# EAGLE design Arduino Mega Breakout - Schematic (EAGLE 6.5.0)
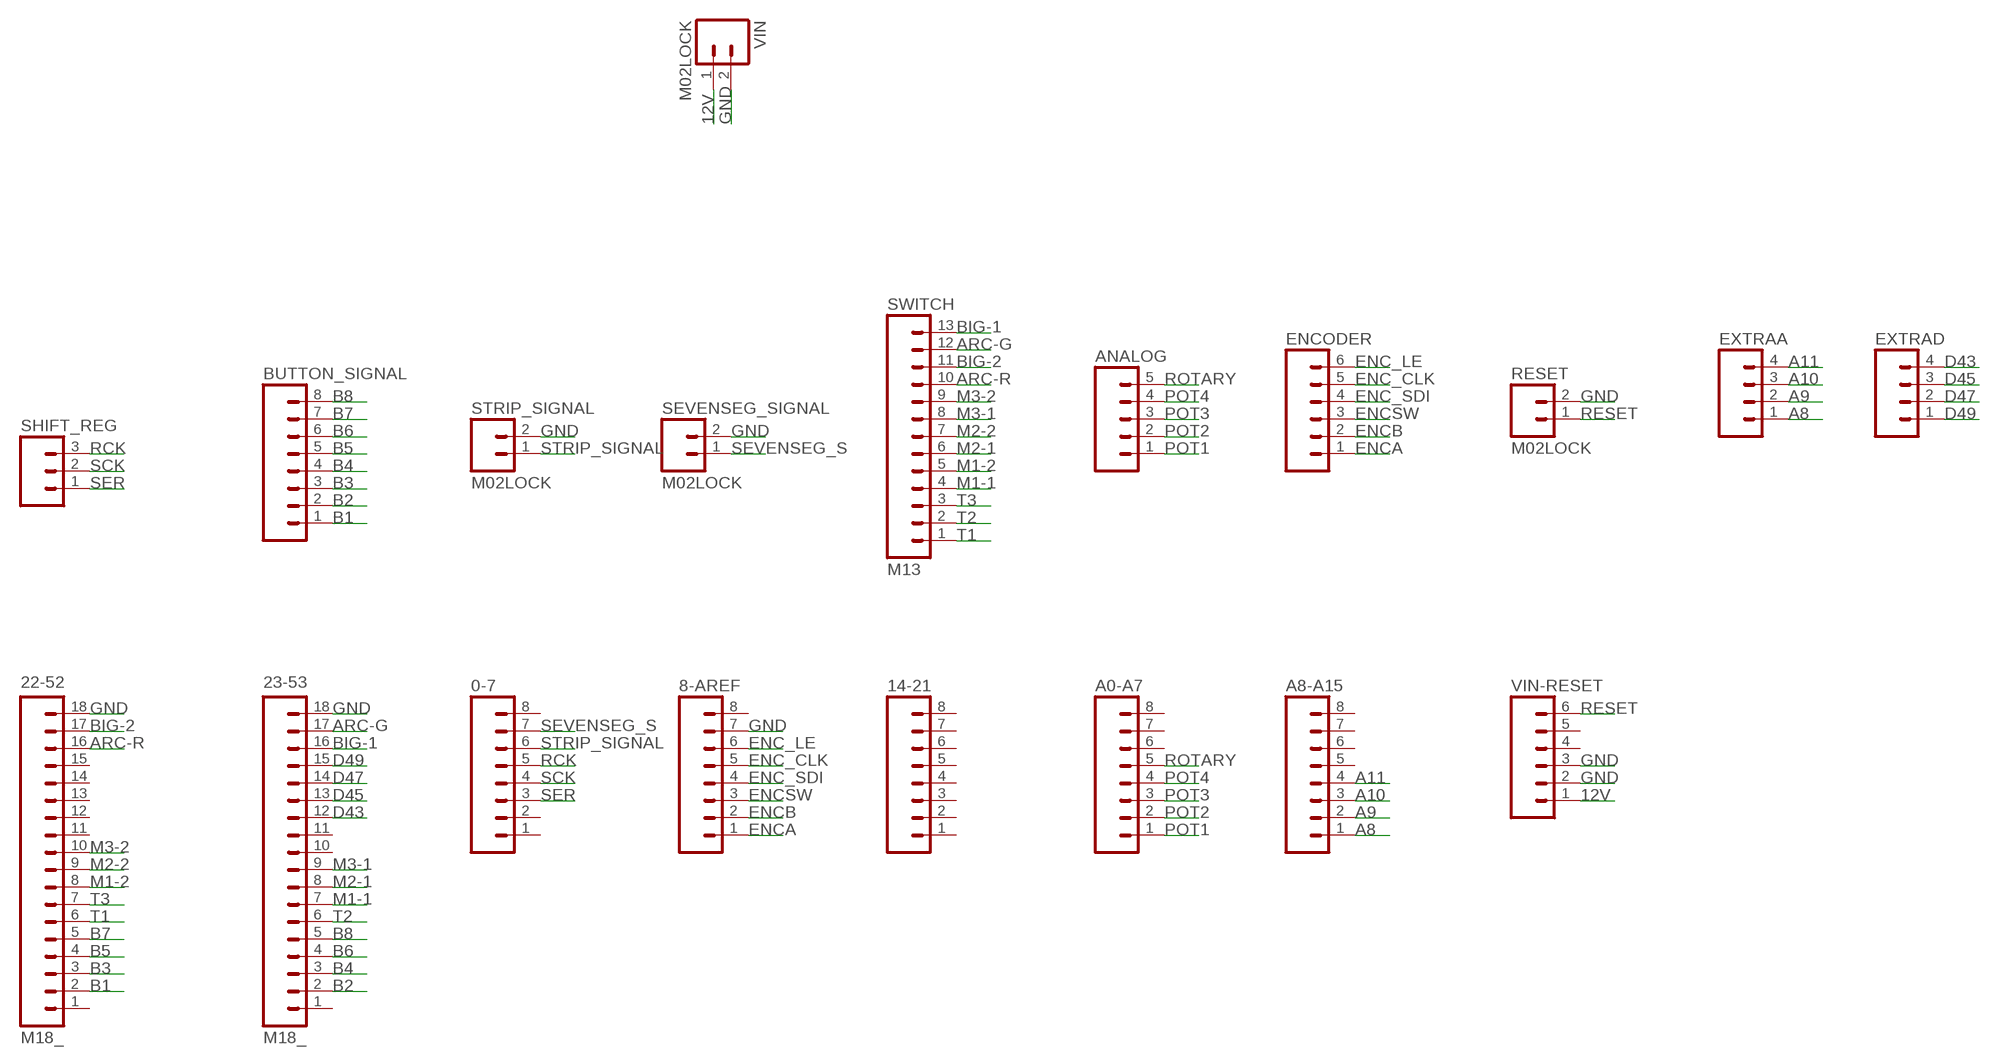
[diagram p0: schematic, sheet 1]

## Parts
0-7  M08LOCK  [1X08_LOCK]
8-AREF  M08LOCK  [1X08_LOCK]
14-21  M08LOCK  [1X08_LOCK]
22-52  M18_  [1X18]
23-53  M18_  [1X18]
A0-A7  M08LOCK  [1X08_LOCK]
A8-A15  M08LOCK  [1X08_LOCK]
ANALOG  M05LOCK  [1X05_LOCK]
BUTTON_SIGNAL  M08  [1X08_PIN1_NO_SILK]
ENCODER  M06LOCK  [1X06_LOCK]
EXTRAA  M04LOCK  [1X04_LOCK]
EXTRAD  M04PTH  [1X04]
RESET  M02LOCK  [1X02_LOCK]
SEVENSEG_SIGNAL  M02LOCK  [1X02_LOCK]
SHIFT_REG  M03LOCK  [1X03_LOCK]
STRIP_SIGNAL  M02LOCK  [1X02_LOCK]
SWITCH  M13  [1X13]
VIN  M02LOCK  [1X02_LOCK]
VIN-RESET  M06LOCK  [1X06_LOCK]

## Nets
12V: VIN-RESET.1 VIN.1
A8: A8-A15.1 EXTRAA.1
A9: A8-A15.2 EXTRAA.2
A10: A8-A15.3 EXTRAA.3
A11: A8-A15.4 EXTRAA.4
ARC-G: 23-53.17 SWITCH.12
ARC-R: 22-52.16 SWITCH.10
B1: 22-52.2 BUTTON_SIGNAL.1
B2: 23-53.2 BUTTON_SIGNAL.2
B3: 22-52.3 BUTTON_SIGNAL.3
B4: 23-53.3 BUTTON_SIGNAL.4
B5: 22-52.4 BUTTON_SIGNAL.5
B6: 23-53.4 BUTTON_SIGNAL.6
B7: 22-52.5 BUTTON_SIGNAL.7
B8: 23-53.5 BUTTON_SIGNAL.8
BIG-1: 23-53.16 SWITCH.13
BIG-2: 22-52.17 SWITCH.11
D43: 23-53.12 EXTRAD.4
D45: 23-53.13 EXTRAD.3
D47: 23-53.14 EXTRAD.2
D49: 23-53.15 EXTRAD.1
ENC_CLK: 8-AREF.5 ENCODER.5
ENC_LE: 8-AREF.6 ENCODER.6
ENC_SDI: 8-AREF.4 ENCODER.4
ENCA: 8-AREF.1 ENCODER.1
ENCB: 8-AREF.2 ENCODER.2
ENCSW: 8-AREF.3 ENCODER.3
GND: 8-AREF.7 22-52.18 23-53.18 RESET.2 SEVENSEG_SIGNAL.2 STRIP_SIGNAL.2 VIN-RESET.2 VIN-RESET.3 VIN.2
M1-1: 23-53.7 SWITCH.4
M1-2: 22-52.8 SWITCH.5
M2-1: 23-53.8 SWITCH.6
M2-2: 22-52.9 SWITCH.7
M3-1: 23-53.9 SWITCH.8
M3-2: 22-52.10 SWITCH.9
POT1: A0-A7.1 ANALOG.1
POT2: A0-A7.2 ANALOG.2
POT3: A0-A7.3 ANALOG.3
POT4: A0-A7.4 ANALOG.4
RCK: 0-7.5 SHIFT_REG.3
RESET: RESET.1 VIN-RESET.6
ROTARY: A0-A7.5 ANALOG.5
SCK: 0-7.4 SHIFT_REG.2
SER: 0-7.3 SHIFT_REG.1
SEVENSEG_S: 0-7.7 SEVENSEG_SIGNAL.1
STRIP_SIGNAL: 0-7.6 STRIP_SIGNAL.1
T1: 22-52.6 SWITCH.1
T2: 23-53.6 SWITCH.2
T3: 22-52.7 SWITCH.3
Unconnected: 0-7.1 0-7.2 0-7.8 8-AREF.8 14-21.1 14-21.2 14-21.3 14-21.4 14-21.5 14-21.6 14-21.7 14-21.8 22-52.1 22-52.11 22-52.12 22-52.13 22-52.14 22-52.15 23-53.1 23-53.10 23-53.11 A0-A7.6 A0-A7.7 A0-A7.8 A8-A15.5 A8-A15.6 A8-A15.7 A8-A15.8 VIN-RESET.4 VIN-RESET.5

## Library data of the parts
0-7 8-AREF 14-21 A0-A7 A8-A15 BUTTON_SIGNAL = SparkFun-Connectors:M08: Header 8 Standard 8-pin 0.1" header. Use with straight break away headers (SKU : PRT-00116), right angle break away headers (PRT-00553), swiss pins (PRT-00743), machine pins (PRT-00117), and female headers (PRT-00115).
22-52 23-53 = SparkFun-Connectors:M18: 1x18 .1" header
ANALOG = SparkFun-Connectors:M05: Header 5 Standard 5-pin 0.1" header. Use with straight break away headers (SKU : PRT-00116), right angle break away headers (PRT-00553), swiss pins (PRT-00743), machine pins (PRT-00117), and female headers (PRT-00115). Molex polarized connector foot print use with SKU : PRT-08230 with associated crimp pins and housings.
ENCODER VIN-RESET = SparkFun-Connectors:M06: Header 6 Standard 6-pin 0.1" header. Use with straight break away headers (SKU : PRT-00116), right angle break away headers (PRT-00553), swiss pins (PRT-00743), machine pins (PRT-00117), and female headers (PRT-00115). Molex polarized connector foot print use with SKU : PRT-08094 with associated crimp pins and housings. NOTES ON THE VARIANTS LOCK and LOCK_LONGPADS... This footprint was designed to help hold the alignment of a through-hole component (i.e. 6-pin header) while soldering it into place. You may notice that each hole has been shifted either up or down by 0.005 of an inch from it's more standard position (which is a perfectly straight line). This slight alteration caused the pins (the squares in the middle) to touch the edges of the holes. Because they are alternating, it causes a "brace" to hold the component in place. 0.005 has proven to be the perfect amount of "off-center" position when using our standard breakaway headers. Although looks a little odd when you look at the bare footprint, once you have a header in there, the alteration is very hard to notice. Also,if you push a header all the way into place, it is covered up entirely on the bottom side. This idea of altering the position of holes to aid alignment will be further integrated into the Sparkfun Library for other footprints. It can help hold any component with 3 or more connection pins.
EXTRAA EXTRAD = SparkFun-Connectors:M04: Header 4 Standard 4-pin 0.1" header. Use with straight break away headers (SKU : PRT-00116), right angle break away headers (PRT-00553), swiss pins (PRT-00743), machine pins (PRT-00117), and female headers (PRT-00115). Molex polarized connector foot print use with SKU : PRT-08231 with associated crimp pins and housings. 1MM SMD Version SKU: PRT-10208
RESET SEVENSEG_SIGNAL STRIP_SIGNAL VIN = SparkFun-Connectors:M02: Standard 2-pin 0.1" header. Use with - straight break away headers ( PRT-00116) - right angle break away headers (PRT-00553) - swiss pins (PRT-00743) - machine pins (PRT-00117) - female headers (PRT-00115) Molex polarized connector foot print use with: PRT-08233 with associated crimp pins and housings. 2.54_SCREWTERM for use with PRT-10571. 3.5mm Screw Terminal footprints for PRT-08084 5mm Screw Terminal footprints for use with PRT-08433
SHIFT_REG = SparkFun-Connectors:M03: Header 3 Standard 3-pin 0.1" header. Use with straight break away headers (SKU : PRT-00116), right angle break away headers (PRT-00553), swiss pins (PRT-00743), machine pins (PRT-00117), and female headers (PRT-00115). Molex polarized connector foot print use with SKU : PRT-08232 with associated crimp pins and housings.
SWITCH = SparkFun-Connectors:M13: 13-pin single row .1" header

## Board
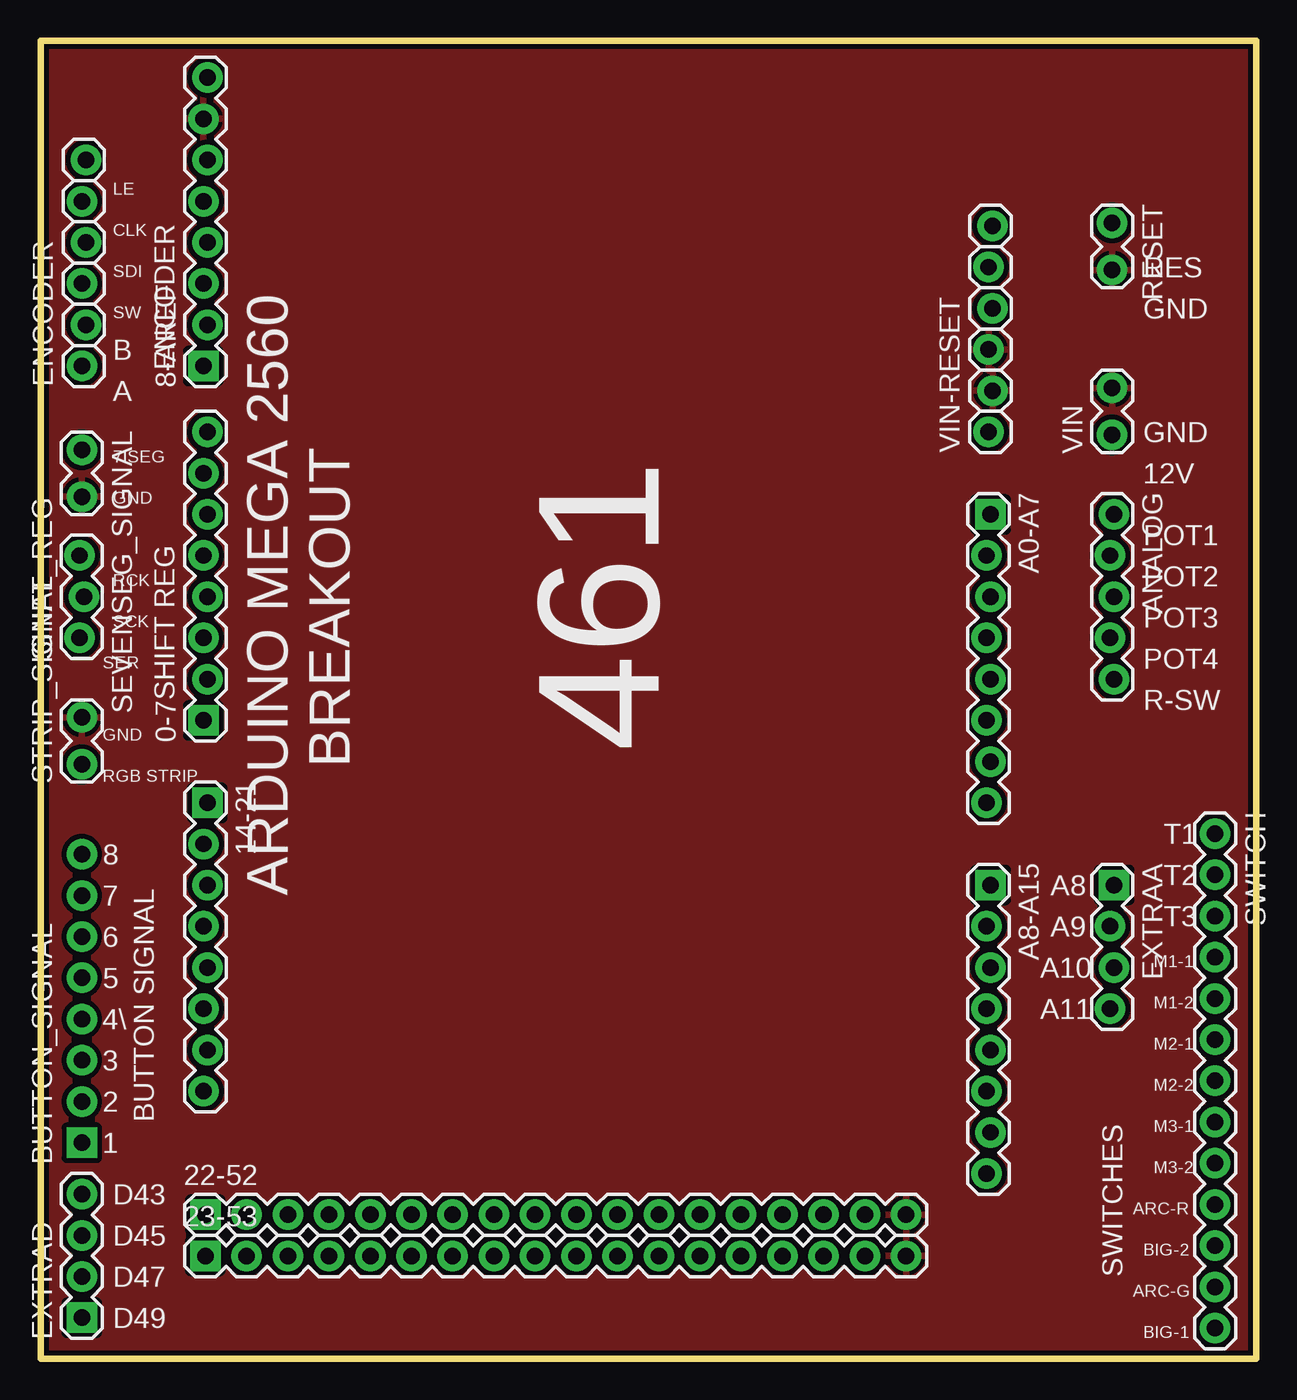
[diagram p1: board, top side]
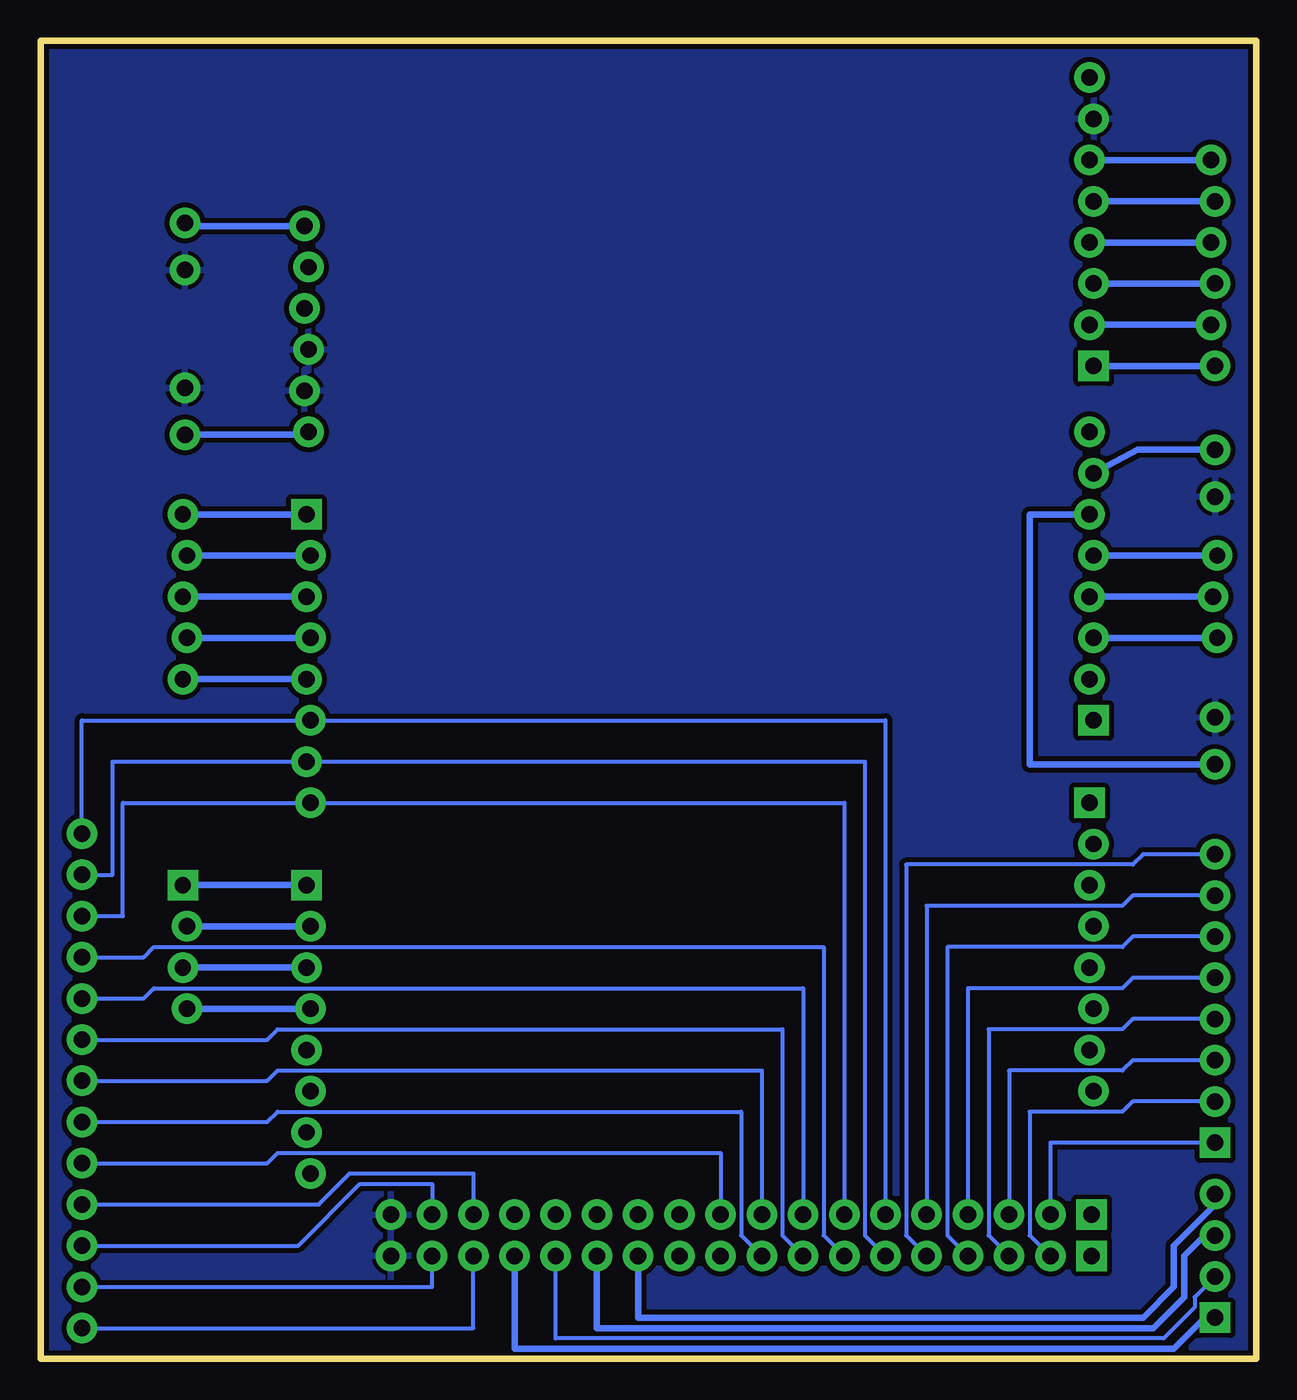
[diagram p2: board, bottom side, seen from below]

Size 74.93 x 81.28 mm. Coordinates in mm from the lower left corner, seen from the top.
Outline: 0,0 0,81.28 74.93,81.28 74.93,0 0,0
Copper layers (1*16): Top 0.035mm / dielectric 1.5mm / Bottom 0.035mm
Design rules "SparkFun": minimum track width 8mil, minimum drill 20mil, track to track 8mil, track to pad 8mil, pad to pad 8mil, via to via 8mil, smd to smd 8mil, copper to edge 8mil, drill to drill 8mil, minimum pad ring 12mil, minimum via ring 10mil, stop-mask expansion 4mil, vias tented up to drill 20mil, thermal gap 10mil

### Footprints (pad centres in the part's own frame; a part is rotated, then mirrored left to right if it is on the bottom)
1X08_LOCK = drill 1.016 pad 1.88 square: 1 0,0.127 | drill 1.016 pad 1.88: 2 2.54,-0.127; 3 5.08,0.127; 4 7.62,-0.127; 5 10.16,0.127; 6 12.7,-0.127; 7 15.24,0.127; 8 17.78,-0.127
1X18 = drill 1.016 pad 1.88 square: 1 0,0 | drill 1.016 pad 1.88: 2 2.54,0; 3 5.08,0; 4 7.62,0; 5 10.16,0; 6 12.7,0; 7 15.24,0; 8 17.78,0; 9 20.32,0; 10 22.86,0; 11 25.4,0; 12 27.94,0; 13 30.48,0; 14 33.02,0; 15 35.56,0; 16 38.1,0; 17 40.64,0; 18 43.18,0
1X05_LOCK = drill 1.016 pad 1.88: 1 0,0.127; 2 2.54,-0.127; 3 5.08,0.127; 4 7.62,-0.127; 5 10.16,0.127
1X08_PIN1_NO_SILK = drill 1.016 pad 1.88 square: 1 0,0 | drill 1.016 pad 1.88: 2 2.54,0; 3 5.08,0; 4 7.62,0; 5 10.16,0; 6 12.7,0; 7 15.24,0; 8 17.78,0
1X06_LOCK = drill 1.016 pad 1.88: 1 0,0; 2 2.54,-0.254; 3 5.08,0; 4 7.62,-0.254; 5 10.16,0; 6 12.7,-0.254
1X04_LOCK = drill 1.016 pad 1.88 square: 1 0,0.127 | drill 1.016 pad 1.88: 2 2.54,-0.127; 3 5.08,0.127; 4 7.62,-0.127
1X04 = drill 1.016 pad 1.88 square: 1 0,0 | drill 1.016 pad 1.88: 2 2.54,0; 3 5.08,0; 4 7.62,0
1X02_LOCK = drill 1.016 pad 1.88: 1 -0.178,0; 2 2.718,0
1X03_LOCK = drill 1.016 pad 1.88: 1 0,0.127; 2 2.54,-0.127; 3 5.08,0.127
1X13 = drill 1.016 pad 1.88: 1 0,0; 2 2.54,0; 3 5.08,0; 4 7.62,0; 5 10.16,0; 6 12.7,0; 7 15.24,0; 8 17.78,0; 9 20.32,0; 10 22.86,0; 11 25.4,0; 12 27.94,0; 13 30.48,0

### Placement (x,y rotation side)
0-7  10.16,39.37 90 top
8-AREF  10.16,61.21 90 top
14-21  10.16,34.29 270 top
22-52  10.16,8.89 0 top
23-53  10.16,6.35 0 top
A0-A7  58.42,52.07 270 top
A8-A15  58.42,29.21 270 top
ANALOG  66.04,52.07 270 top
BUTTON_SIGNAL  2.54,13.34 90 top
ENCODER  2.54,61.21 90 top
EXTRAA  66.04,29.21 270 top
EXTRAD  2.54,2.54 90 top
RESET  66.04,69.85 270 top
SEVENSEG_SIGNAL  2.54,55.88 270 top
SHIFT_REG  2.54,44.45 90 top
STRIP_SIGNAL  2.54,36.83 90 top
SWITCH  72.39,32.38 270 top
VIN  66.04,57.15 90 top
VIN-RESET  58.42,57.15 90 top

### Tracks (layer width: path | path; a pad name or v marks a point on that pad's centre or on a via)
12V
  Bottom 0.406: VIN.1 58.42,56.97 VIN-RESET.1
A8
  Bottom 0.406: A8-A15.1 EXTRAA.1
A9
  Bottom 0.406: A8-A15.2 EXTRAA.2
A10
  Bottom 0.406: EXTRAA.3 A8-A15.3
A11
  Bottom 0.406: EXTRAA.4 A8-A15.4
ARC-G
  Bottom 0.254: SWITCH.12 50.8,4.45 23-53.17
ARC-R
  Bottom 0.254: SWITCH.10 57.78,9.53 55.88,11.43 48.26,11.43 22-52.16
B1
  Bottom 0.254: BUTTON_SIGNAL.1 12.7,13.34 22-52.2
B2
  Bottom 0.254: BUTTON_SIGNAL.2 7.62,15.88 8.26,15.24 13.97,15.24 13.97,7.62 23-53.2
B3
  Bottom 0.254: BUTTON_SIGNAL.3 7.62,18.41 8.26,17.78 15.24,17.78 22-52.3
B4
  Bottom 0.254: BUTTON_SIGNAL.4 7.62,20.95 8.26,20.32 16.51,20.32 16.51,7.62 23-53.3
B5
  Bottom 0.254: BUTTON_SIGNAL.5 7.62,23.5 8.26,22.86 17.78,22.86 22-52.4
B6
  Bottom 0.254: BUTTON_SIGNAL.6 7.62,26.04 8.26,25.4 19.05,25.4 19.05,7.62 23-53.4
B7
  Bottom 0.254: BUTTON_SIGNAL.7 7.62,28.57 8.26,27.94 20.32,27.94 22-52.5
B8
  Bottom 0.254: BUTTON_SIGNAL.8 6.99,31.11 7.62,30.48 21.59,30.48 21.59,7.62 23-53.5
BIG-1
  Bottom 0.254: SWITCH.13 48.26,1.91 23-53.16
BIG-2
  Bottom 0.254: SWITCH.11 59.05,6.99 55.24,10.79 50.8,10.79 22-52.17
D43
  Bottom 0.406: EXTRAD.4 2.54,9.53 5.08,6.99 5.08,4.45 6.99,2.54 38.1,2.54 23-53.12
D45
  Bottom 0.406: EXTRAD.3 3.17,7.62 4.45,6.35 4.45,3.81 6.35,1.91 40.64,1.91 23-53.13
D47
  Bottom 0.254: EXTRAD.2 3.81,3.81 3.81,3.17 5.71,1.27 43.18,1.27 23-53.14
D49
  Bottom 0.406: EXTRAD.1 3.17,2.54 5.08,0.64 45.72,0.64 23-53.15
ENC_CLK
  Bottom 0.406: 8-AREF.5 ENCODER.5
ENC_LE
  Bottom 0.406: ENCODER.6 8-AREF.6
ENC_SDI
  Bottom 0.406: ENCODER.4 8-AREF.4
ENCA
  Bottom 0.406: 8-AREF.1 ENCODER.1
ENCB
  Bottom 0.406: ENCODER.2 8-AREF.2
ENCSW
  Bottom 0.406: 8-AREF.3 ENCODER.3
GND
  pour Top (isolate 0.305): 0,0 0,81.28 74.93,81.28 74.93,0
  pour Bottom (isolate 0.305): 0,0 0,81.28 74.93,81.28 74.93,0
M1-1
  Bottom 0.254: SWITCH.4 68.58,24.77 67.94,25.4 26.67,25.4 26.67,7.62 23-53.7
M1-2
  Bottom 0.254: SWITCH.5 68.58,22.23 67.94,22.86 27.94,22.86 22-52.8
M2-1
  Bottom 0.254: SWITCH.6 60.96,19.68 60.33,20.32 29.21,20.32 29.21,7.62 23-53.8
M2-2
  Bottom 0.254: SWITCH.7 60.96,17.14 60.33,17.78 30.48,17.78 22-52.9
M3-1
  Bottom 0.254: SWITCH.8 60.96,14.61 60.33,15.24 31.75,15.24 31.75,7.62 23-53.9
M3-2
  Bottom 0.254: SWITCH.9 60.96,12.06 60.33,12.7 33.02,12.7 22-52.10
POT1
  Bottom 0.406: A0-A7.1 ANALOG.1
POT2
  Bottom 0.406: ANALOG.2 A0-A7.2
POT3
  Bottom 0.406: A0-A7.3 ANALOG.3
POT4
  Bottom 0.406: ANALOG.4 A0-A7.4
RCK
  Bottom 0.406: SHIFT_REG.3 0-7.5
RESET
  Bottom 0.406: VIN-RESET.6 66.04,69.85 RESET.1
ROTARY
  Bottom 0.406: A0-A7.5 ANALOG.5
SCK
  Bottom 0.406: SHIFT_REG.2 0-7.4
SER
  Bottom 0.406: SHIFT_REG.1 0-7.3
SEVENSEG_S
  Bottom 0.406: SEVENSEG_SIGNAL.1 7.32,56.06 0-7.7
STRIP_SIGNAL
  Bottom 0.406: STRIP_SIGNAL.1 13.97,36.65 13.97,52.07 0-7.6
T1
  Bottom 0.254: SWITCH.1 72.39,39.37 22.86,39.37 22-52.6
T2
  Bottom 0.254: SWITCH.2 70.48,29.84 70.48,36.83 24.13,36.83 24.13,7.62 23-53.6
T3
  Bottom 0.254: SWITCH.3 69.85,27.3 69.85,34.29 25.4,34.29 22-52.7

### Text on the board
tPlace: LE | CLK | SDI | RES | SW | GND | B | ENCODER | A | GND | 7 SEG | 12V | GND | POT1 | RCK | POT2 | SCK | POT3 | SER | POT4 | SHIFT REG | R-SW | GND | 461 | RGB STRIP | T1 | 8 | ARDUINO MEGA 2560 / BREAKOUT | A8 | T2 | 7 | T3 | A9 | 6 | M1-1 | 5 | A10 | M1-2 | A11 | 4\ | M2-1 | 3 | M2-2 | 2 | BUTTON SIGNAL | M3-1 | 1 | M3-2 | D43 | ARC-R | D45 | BIG-2 | SWITCHES | D47 | ARC-G | D49 | BIG-1